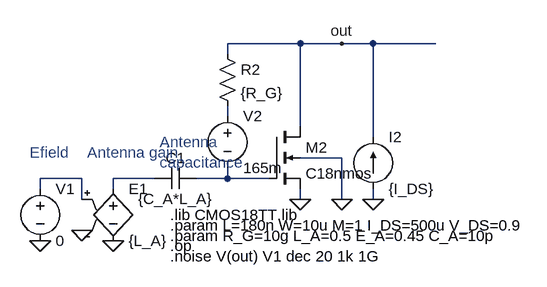
[diagram p0: schematic CSstageCapnoise.asc]
CSstageCapnoise.asc, the LTspice schematic file:
Version 4
SHEET 1 900 680
WIRE 208 -528 96 -528
WIRE 272 -528 208 -528
WIRE 320 -528 272 -528
WIRE 416 -528 320 -528
WIRE 96 -512 96 -528
WIRE 96 -416 96 -432
WIRE 208 -400 208 -528
WIRE 320 -384 320 -528
WIRE 272 -352 208 -352
WIRE -128 -320 -192 -320
WIRE -16 -320 -80 -320
WIRE 96 -320 96 -336
WIRE 96 -320 48 -320
WIRE 160 -320 96 -320
WIRE -192 -304 -192 -320
WIRE -80 -304 -80 -320
WIRE -128 -288 -128 -320
WIRE 208 -288 208 -304
WIRE 272 -288 272 -352
WIRE 320 -288 320 -304
FLAG 272 -288 0
FLAG 208 -288 0
FLAG 320 -288 0
FLAG -80 -224 0
FLAG -128 -240 0
FLAG -192 -224 0
FLAG 272 -528 out
DATAFLAG 384 -528 ""
SYMBOL nmos4 160 -400 R0
SYMATTR InstName M2
SYMATTR Value C18nmos
SYMATTR Value2 l={L} w={W} ad={w*500n} as={w*500n} pd={2*w+1u} ps={2*w+1u} m={m}
SYMBOL voltage 96 -432 R0
WINDOW 123 0 0 Left 0
WINDOW 39 0 0 Left 0
SYMATTR InstName V2
SYMATTR Value 165m
SYMBOL current 320 -304 M180
WINDOW 0 24 80 Left 2
WINDOW 3 24 0 Left 2
SYMATTR InstName I2
SYMATTR Value {I_DS}
SYMBOL res 80 -528 R0
SYMATTR InstName R2
SYMATTR Value {R_G}
SYMBOL cap 48 -336 R90
WINDOW 0 0 32 VBottom 2
WINDOW 3 32 32 VTop 2
SYMATTR InstName C1
SYMATTR Value {C_A*L_A}
SYMBOL voltage -192 -320 R0
WINDOW 123 0 0 Left 0
WINDOW 39 0 0 Left 0
SYMATTR InstName V1
SYMATTR Value 0
SYMBOL e -80 -320 R0
SYMATTR InstName E1
SYMATTR Value {L_A}
TEXT 8 -248 Left 2 !.param L=180n W=10u M=1 I_DS=500u V_DS=0.9
TEXT 8 -264 Left 2 !.lib CMOS18TT.lib
TEXT 8 -232 Left 2 !.param R_G=10g L_A=0.5 E_A=0.45 C_A=10p
TEXT 8 -216 Left 2 !.op
TEXT 8 -200 Left 2 !.noise V(out) V1 dec 20 1k 1G
TEXT -208 -360 Left 2 ;Efield
TEXT -120 -360 Left 2 ;Antenna gain
TEXT -8 -376 Left 2 ;Antenna \ncapacitance

The netlist it stands for:
* CSstageCapnoise.asc
M2 out N004 0 0 C18nmos l={L} w={W} ad={w*500n} as={w*500n} pd={2*w+1u} ps={2*w+1u} m={m}
V2 N001 N004 165m
I2 0 out {I_DS}
R2 out N001 {R_G}
C1 N004 N003 {C_A*L_A}
V1 N002 0 0
E1 N003 0 N002 0 {L_A}
.model NMOS NMOS
.model PMOS PMOS
.lib standard.mos
.param L=180n W=10u M=1 I_DS=500u V_DS=0.9
.lib CMOS18TT.lib
.param R_G=10g L_A=0.5 E_A=0.45 C_A=10p
.op
.noise V(out) V1 dec 20 1k 1G
* Efield
* Antenna gain
* Antenna
* capacitance
.backanno
.end